# EAGLE design Heart-shaped-LED (EAGLE 9.0.0)
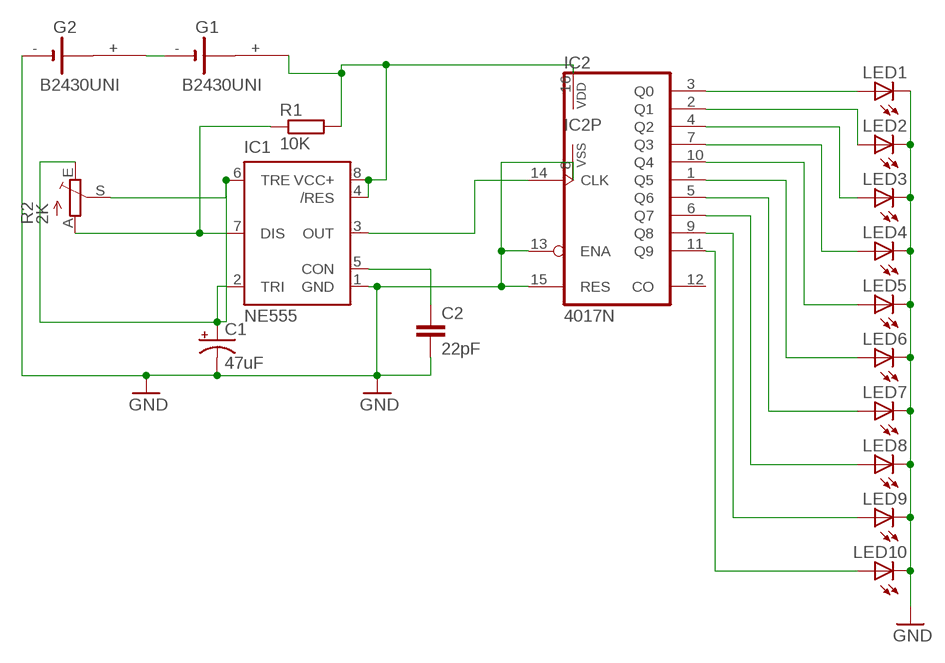
[diagram p0: schematic, sheet 1]

## Parts
C1  47uF  CPOL-USB45181A  [B45181A]
C2  22pF  C-EU025-024X044  [C025-024X044]
G1  B2430UNI  [B2430UNI]
G2  B2430UNI  [B2430UNI]
IC1  NE555  [DIL-08]
IC2  4017N  [DIL16]
LED1  LED5MM  [LED5MM]
LED2  LED5MM  [LED5MM]
LED3  LED5MM  [LED5MM]
LED4  LED5MM  [LED5MM]
LED5  LED5MM  [LED5MM]
LED6  LED5MM  [LED5MM]
LED7  LED5MM  [LED5MM]
LED8  LED5MM  [LED5MM]
LED9  LED5MM  [LED5MM]
LED10  LED5MM  [LED5MM]
R1  10K  R-EU_0207/7  [0207/7]
R2  2K  TRIM_EU-CA9V  [CA9V]

## Nets
GND: C1.- C2.2 G2.- IC1.1(GND) IC2.8(VSS) IC2.13(ENA) IC2.15(RES) LED1.K(C) LED2.K(C) LED3.K(C) LED4.K(C) LED5.K(C) LED6.K(C) LED7.K(C) LED8.K(C) LED9.K(C) LED10.K(C)
N$1: IC1.3(OUT) IC2.14(CLK)
N$2: G1.+ IC1.4(/RES) IC1.8(VCC+) IC2.16(VDD) R1.2
N$3: IC2.3(Q0) LED1.A
N$4: IC1.7(DIS) R1.1 R2.A
N$5: C1.+ IC1.2(TRI) IC1.6(TRE) R2.E R2.S
N$6: C2.1 IC1.5(CON)
N$7: IC2.2(Q1) LED2.A
N$8: IC2.4(Q2) LED3.A
N$9: IC2.7(Q3) LED4.A
N$10: IC2.10(Q4) LED5.A
N$11: IC2.1(Q5) LED6.A
N$12: IC2.5(Q6) LED7.A
N$13: IC2.6(Q7) LED8.A
N$14: IC2.9(Q8) LED9.A
N$15: IC2.11(Q9) LED10.A
N$16: G1.- G2.+
Unconnected: G1.+@1(+) G1.+@2(+) G1.+@3(+) G1.+@4(+) G1.-@1(-) G2.+@1(+) G2.+@2(+) G2.+@3(+) G2.+@4(+) G2.-@1(-) IC2.12(CO)

## Library data of the parts
C1 = rcl:CPOL-US: POLARIZED CAPACITOR, American symbol; SPICEPREFIX: C
C2 = rcl:C-EU: CAPACITOR, European symbol; SPICEPREFIX: C
G1 G2 = battery:B2430UNI: LI BATTERY
IC1 = st-microelectronics:NE555: General purpose bipolar Timer; MF: Arrow Electronics; MPN: NE555N; OC_FARNELL: 1467742; OC_NEWARK: 89K1486
IC2 = 40xx:4017: COUNTER/DIVIDER; SPICEPREFIX: X
LED1-LED10 = led:LED: LED OSRAM: - CHIPLED LG R971, LG N971, LY N971, LG Q971, LY Q971, LO R971, LY R971 LH N974, LH R974 LS Q976, LO Q976, LY Q976 LO Q996 - Hyper CHIPLED LW Q18S LB Q993, LB Q99A, LB R99A - SideLED LS A670, LO A670, LY A670, LG A670, LP A670 LB A673, LV A673, LT A673, LW A673 LH A674 LY A675 LS A676, LA A676, LO A676, LY A676, LW A676 LS A679, LY A679, LG A679 - Hyper Micro SIDELED® LS Y876, LA Y876, LO Y876, LY Y876 LT Y87S - SmartLED LW L88C, LW L88S LB L89C, LB L89S, LG L890 LS L89K, LO L89K, LY L89K LS L896, LA L896, LO L896, LY L896 - TOPLED LS T670, LO T670, LY T670, LG T670, LP T670 LSG T670, LSP T670, LSY T670, LOP T670, LYG T670 LG T671, LOG T671, LSG T671 LB T673, LV T673, LT T673, LW T673 LH T674 LS T676, LA T676, LO T676, LY T676, LB T676, LH T676, LSB T676, LW T676 LB T67C, LV T67C, LT T67C, LS T67K, LO T67K, LY T67K, LW E67C LS E67B, LA E67B, LO E67B, LY E67B, LB E67C, LV E67C, LT E67C LW T67C LS T679, LY T679, LG T679 LS T770, LO T770, LY T770, LG T770, LP T770 LB T773, LV T773, LT T773, LW T773 LH T774 LS E675, LA E675, LY E675, LS T675 LS T776, LA T776, LO T776, LY T776, LB T776 LHGB T686 LT T68C, LB T68C - Hyper Mini TOPLED® LB M676 - Mini TOPLED Santana® LG M470 LS M47K, LO M47K, LY M47K Source: http://www.osram.convergy.de LUXEON: - LUMILED® LXK2-PW12-R00, LXK2-PW12-S00, LXK2-PW14-U00, LXK2-PW14-V00 LXK2-PM12-R00, LXK2-PM12-S00, LXK2-PM14-U00 LXK2-PE12-Q00, LXK2-PE12-R00, LXK2-PE12-S00, LXK2-PE14-T00, LXK2-PE14-U00 LXK2-PB12-K00, LXK2-PB12-L00, LXK2-PB12-M00, LXK2-PB14-N00, LXK2-PB14-P00, LXK2-PB14-Q00 LXK2-PR12-L00, LXK2-PR12-M00, LXK2-PR14-Q00, LXK2-PR14-R00 LXK2-PD12-Q00, LXK2-PD12-R00, LXK2-PD12-S00 LXK2-PH12-R00, LXK2-PH12-S00 LXK2-PL12-P00, LXK2-PL12-Q00, LXK2-PL12-R00 Source: www.luxeon.com KINGBRIGHT: KA-3528ASYC Source: www.kingbright.com
R1 = rcl:R-EU_: RESISTOR, European symbol; SPICEPREFIX: R
R2 = pot:TRIM_EU-: POTENTIOMETER

## Board
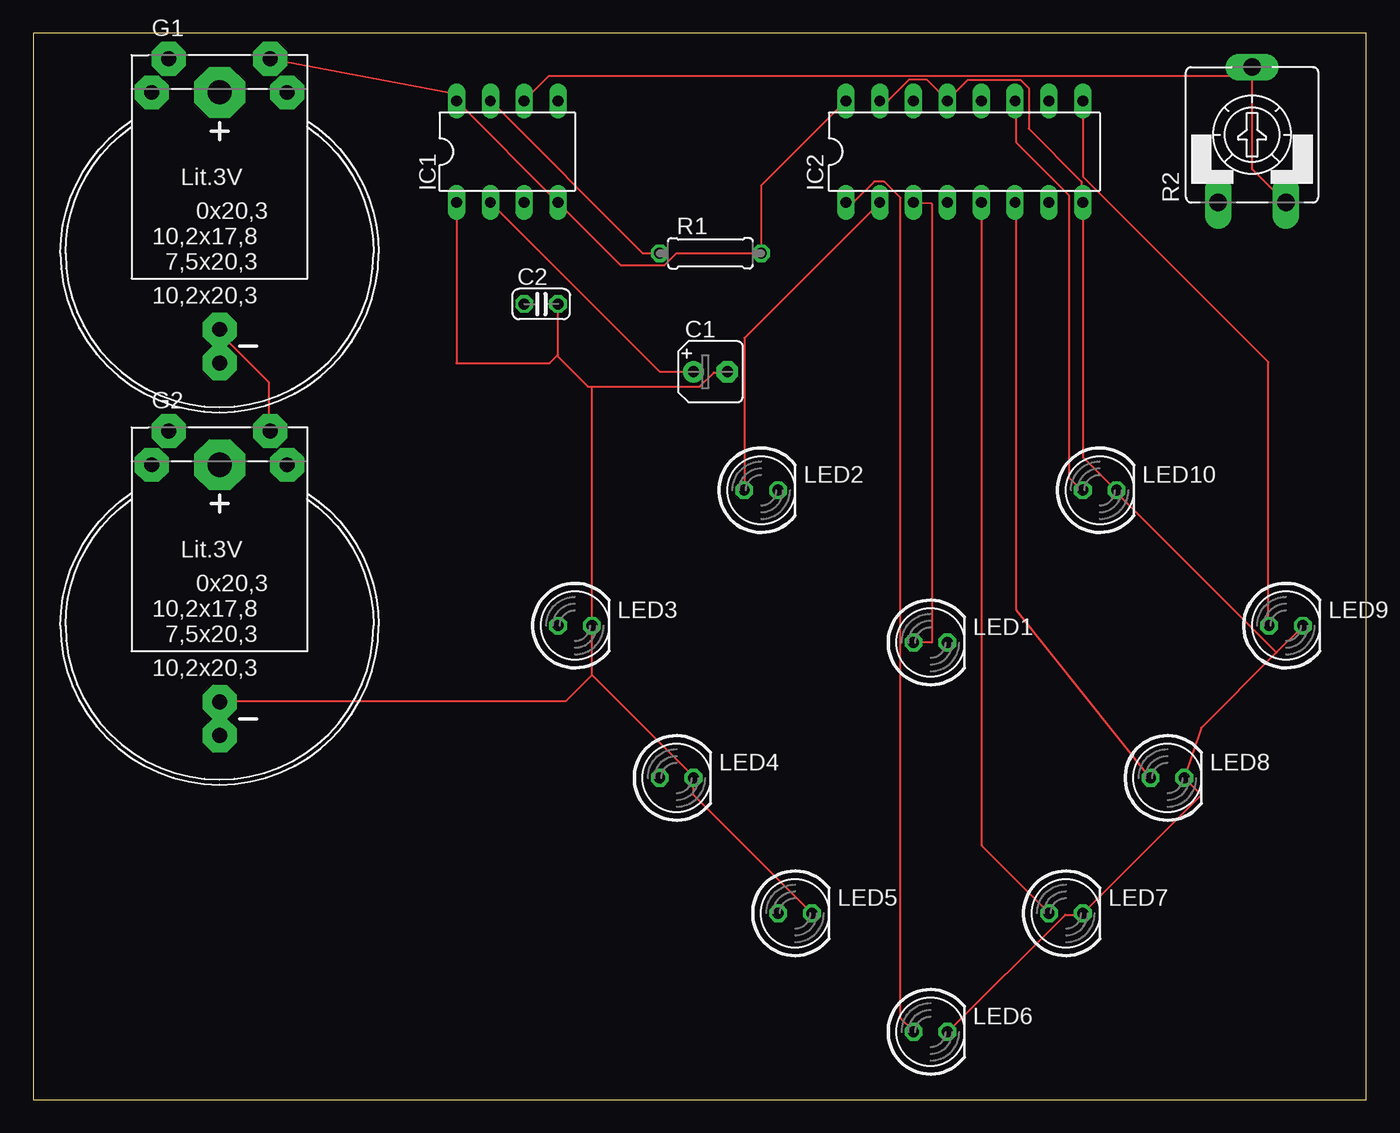
[diagram p1: board, top side]
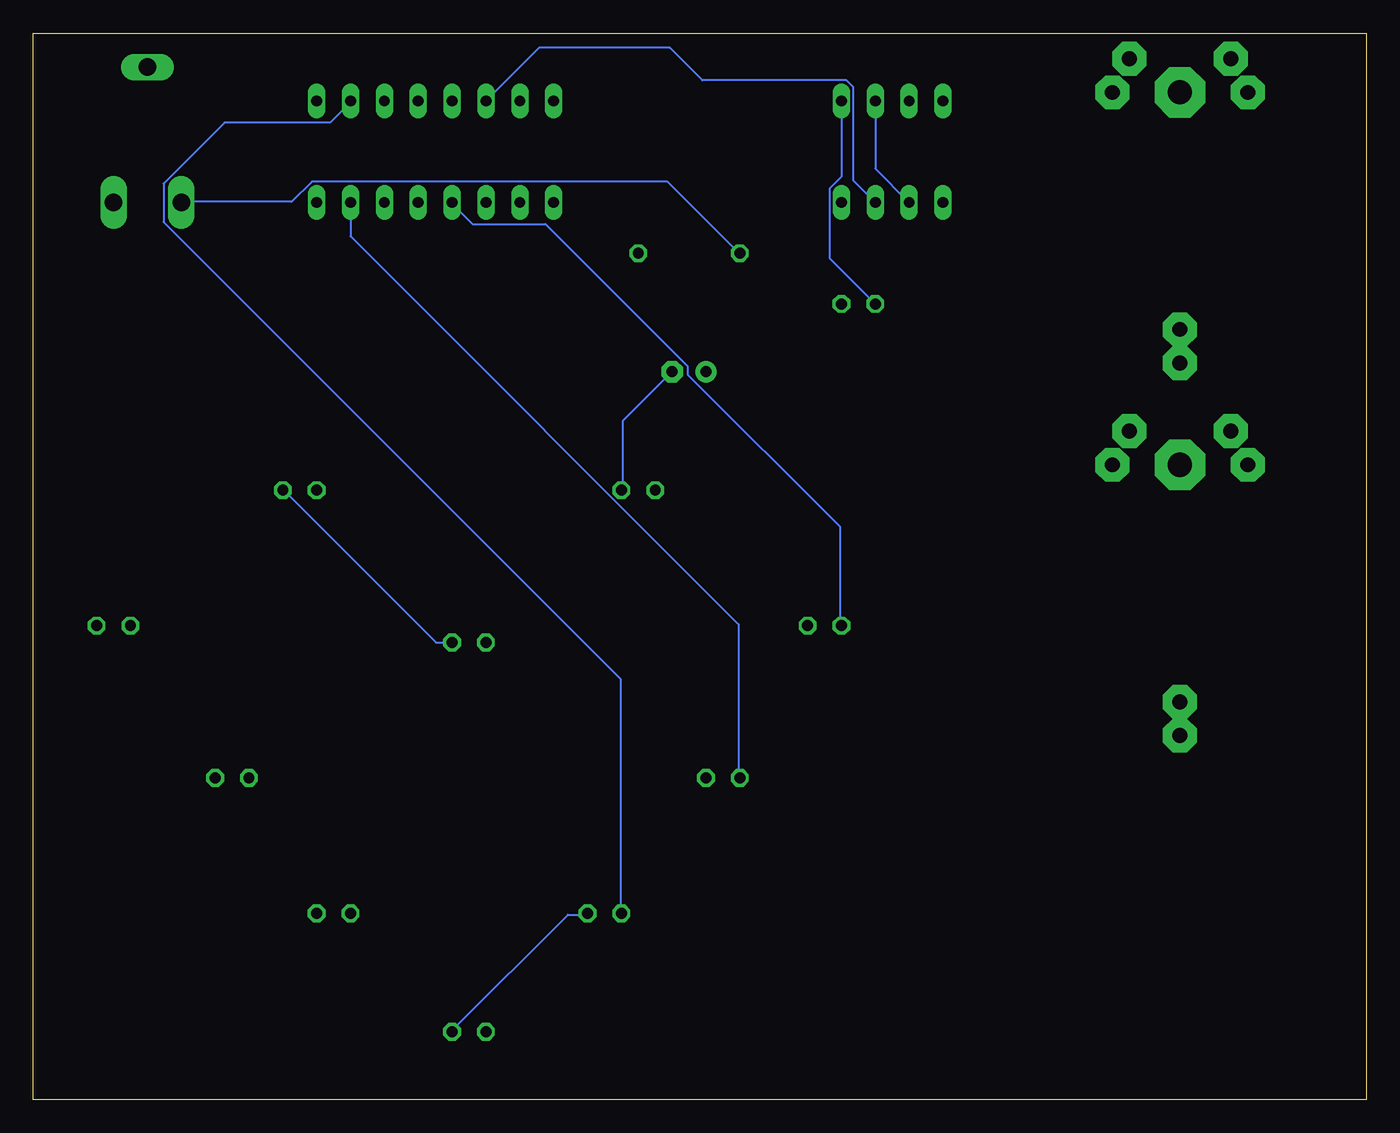
[diagram p2: board, bottom side, seen from below]

Size 100 x 80 mm. Coordinates in mm from the lower left corner, seen from the top.
Outline: 0,0 100,0 100,80 0,80 0,0
Copper layers (1*16): Top 0.035mm / dielectric 1.5mm / Bottom 0.035mm
Design rules "default": minimum track width 6mil, minimum drill 0.35mm, track to track 6mil, track to pad 6mil, pad to pad 6mil, via to via 6mil, smd to smd 6mil, copper to edge 40mil, drill to drill 6mil, minimum pad ring 10mil, minimum via ring 8mil, stop-mask expansion 4mil, vias tented up to drill 0mil, thermal gap 10mil

### Footprints (pad centres in the part's own frame; a part is rotated, then mirrored left to right if it is on the bottom)
B45181A = drill 0.813 pad 1.6: + -1.27,0 | drill 0.813 pad 1.6 octagon: - 1.27,0
C025-024X044 = drill 0.813 octagon: 1 -1.27,0; 2 1.27,0
B2430UNI = drill 1.118 pad 2.54 octagon: + 3.81,14.605; +@1 -3.81,14.605; +@2 -5.08,12.065; +@3 5.08,12.065; - 0,-5.715; -@1 0,-8.255 | drill 1.803 pad 3.81 octagon: +@4 0,12.065
DIL-08 = drill 0.813 long: 1 -3.81,-3.81; 2 -1.27,-3.81; 3 1.27,-3.81; 4 3.81,-3.81; 5 3.81,3.81; 6 1.27,3.81; 7 -1.27,3.81; 8 -3.81,3.81
DIL16 = drill 0.813 long: 1 -8.89,-3.81; 2 -6.35,-3.81; 3 -3.81,-3.81; 4 -1.27,-3.81; 5 1.27,-3.81; 6 3.81,-3.81; 7 6.35,-3.81; 8 8.89,-3.81; 9 8.89,3.81; 10 6.35,3.81; 11 3.81,3.81; 12 1.27,3.81; 13 -1.27,3.81; 14 -3.81,3.81; 15 -6.35,3.81; 16 -8.89,3.81
LED5MM = drill 0.813 octagon: A -1.27,0; K 1.27,0
0207/7 = drill 0.813 octagon: 1 -3.81,0; 2 3.81,0
CA9V = drill 1.321 long: A -2.54,-5.08; E 2.54,-5.08; S 0,5.08

### Placement (x,y rotation side)
C1  50.8,54.61 0 top
C2  38.1,59.69 0 top
G1  13.97,63.5 0 top
G2  13.97,35.56 0 top
IC1  35.56,71.12 0 top
IC2  69.85,71.12 0 top
LED1  67.31,34.29 0 top
LED2  54.61,45.72 0 top
LED3  40.64,35.56 0 top
LED4  48.26,24.13 0 top
LED5  57.15,13.97 0 top
LED6  67.31,5.08 0 top
LED7  77.47,13.97 0 top
LED8  85.09,24.13 0 top
LED9  93.98,35.56 0 top
LED10  80.01,45.72 0 top
R1  50.8,63.5 0 top
R2  91.44,72.39 0 top

### Tracks (layer width: path | path; a pad name or v marks a point on that pad's centre or on a via)
GND
  Top 0.152: 39.29,55.8 38.73,55.24 31.75,55.24 IC1.1 | 39.29,55.8 39.37,55.88 C2.2 | 68.58,74.98 67.06,76.5 65.68,76.5 64.16,74.98 63.55,74.98 IC2.15 | 68.58,74.98 70.1,76.5 74.07,76.5 74.68,75.89 74.68,72.85 78.64,68.89 78.64,67.36 IC2.8 78.79,67.21 78.79,48.16 81.23,45.72 LED10.K 81.38,45.72 81.38,45.41 93.27,33.53 | 68.58,74.98 IC2.13 | 41.91,53.49 41.6,53.49 39.29,55.8 | 41.91,53.49 49.99,53.49 51.05,54.56 51.97,54.56 C1.- | 93.27,33.53 95.25,35.51 LED9.K | 93.27,33.53 87.63,27.89 LED8.K 87.63,22.86 LED7.K 78.64,13.87 77.42,13.87 68.58,5.03 LED6.K | LED5.K 49.53,22.86 LED4.K 49.53,24.23 41.91,31.85 | 41.91,31.85 LED3.K 41.91,53.49 | 41.91,31.85 39.93,29.87 14.02,29.87 G2.-
  Bottom 0.152: LED1.K 69.8,34.29 81.23,45.72 LED10.K | C1.- 55.78,50.9 55.78,45.72 LED2.K | LED5.K 58.52,13.87 59.89,13.87 68.58,5.18 LED6.K
N$1
  Bottom 0.152: IC1.3 38.48,68.96 38.48,75.96 39,76.48 49.81,76.48 52.24,78.91 62.06,78.91 IC2.14
N$2
  Top 0.152: G1.+ 31.11,75.56 IC1.8 IC1.4 44.07,62.61 47.36,62.61 48.25,63.5 R1.2 54.61,68.58 IC2.16
N$3
  Top 0.152: LED1.A 67.41,34.29 67.41,67.21 IC2.3
N$4
  Top 0.152: IC1.7 45.72,63.5 R1.1
  Bottom 0.152: R2.A 88.85,67.36 80.62,67.36 79.1,68.89 52.43,68.89 47.09,63.55 R1.1
N$5
  Top 0.152: IC1.2 46.99,54.61 C1.+ | 91.44,76.81 91.44,69.8 93.88,67.36 R2.E | 91.44,76.81 R2.S 91.44,77.42 | 91.44,76.81 38.71,76.81 IC1.6
  Bottom 0.152: IC1.6 36.83,69.85 IC1.2
N$6
  Bottom 0.152: IC1.5 39.37,69.23 40.26,68.34 40.26,63.12 C2.1
N$7
  Top 0.152: LED2.A 53.34,57.15 IC2.2
N$8
  Bottom 0.152: LED3.A 39.47,35.66 39.47,42.98 50.9,54.41 50.9,55.02 61.57,65.68 67.06,65.68 68.58,67.21 IC2.4
N$9
  Bottom 0.152: IC2.7 76.2,64.77 47.09,35.66 47.09,24.23 LED4.A
N$10
  Bottom 0.152: LED5.A 55.93,14.02 55.93,31.55 90.22,65.84 90.22,68.73 85.65,73.3 77.72,73.3 76.2,74.83 IC2.10
N$11
  Top 0.152: IC2.1 60.96,67.36 61.57,67.36 63.09,68.89 63.86,68.89 65.08,67.67 65.08,6.1 65.99,5.18 LED6.A
N$12
  Top 0.152: IC2.5 71.17,67.21 71.17,19.05 76.2,14.02 LED7.A
N$13
  Top 0.152: LED8.A 73.76,36.73 73.76,67.21 IC2.6
N$14
  Top 0.152: IC2.9 78.79,74.83 78.79,69.19 92.66,55.32 92.66,35.66 LED9.A
N$15
  Top 0.152: IC2.11 73.76,74.83 73.76,71.78 77.72,67.82 77.72,46.63 78.64,45.72 LED10.A
N$16
  Top 0.152: G1.- 14.02,57.76 14.02,57.45 17.68,53.8 17.68,50.29 G2.+